# Altium schematic sheet owm_if.SCHDOC
size A4; Organization: Microprocessor-Design Pty Ltd; Address1: 18/110 Caroline Street; Address2: South Yarra; Address3: VIC 3141; Address4: Australia; DocumentNumber: 3; SheetNumber: 3; SheetTotal: 3
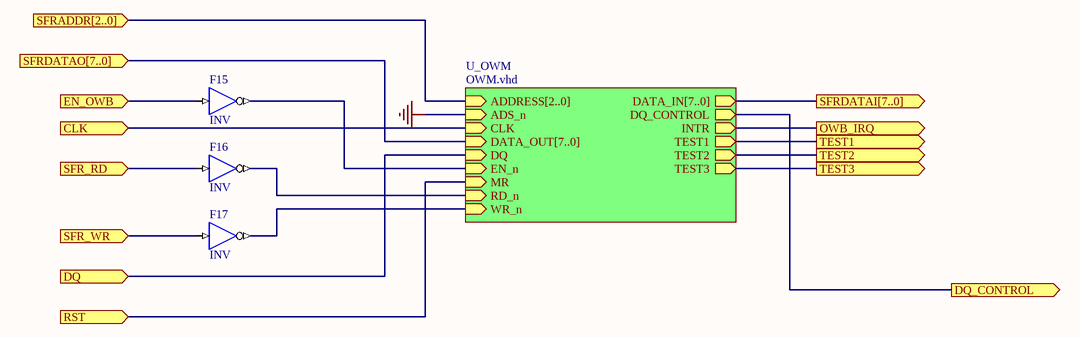
[diagram p0: owm_if.SCHDOC]

## Parts
F15  INV
F16  INV
F17  INV

## Sub-sheets
U_OWM = OWM.vhd: ADDRESS[2..0] (in), ADS_n (in), CLK (in), DATA_IN[7..0] (out), DATA_OUT[7..0] (in), DQ (in), DQ_CONTROL (out), EN_n (in), INTR (out), MR (in), RD_n (in), TEST1 (out), TEST2 (out), TEST3 (out), WR_n (in)  | VHDLENTITY: OWM

## Ports
CLK (in), DQ (in), DQ_CONTROL (out), EN_OWB (in), OWB_IRQ (out), RST (in), SFR_RD (in), SFR_WR (in), SFRADDR[2..0] (in), SFRDATAI[7..0] (out), SFRDATAO[7..0] (in), TEST1 (out), TEST2 (out), TEST3 (out)

## Nets
GND: sheet U_OWM/ADS_n
CLK: port CLK, sheet U_OWM/CLK
DQ: port DQ, sheet U_OWM/DQ
DQ_CONTROL: port DQ_CONTROL, sheet U_OWM/DQ_CONTROL
EN_OWB: F15.I ; port EN_OWB
OWB_IRQ: port OWB_IRQ, sheet U_OWM/INTR
RST: port RST, sheet U_OWM/MR
SFR_RD: F16.I ; port SFR_RD
SFR_WR: F17.I ; port SFR_WR
TEST1: port TEST1, sheet U_OWM/TEST1
TEST2: port TEST2, sheet U_OWM/TEST2
TEST3: port TEST3, sheet U_OWM/TEST3
NetF15_O: F15.O ; sheet U_OWM/EN_n
NetF16_O: F16.O ; sheet U_OWM/RD_n
NetF17_O: F17.O ; sheet U_OWM/WR_n

## Buses and harness runs
bus port SFRADDR[2..0] = sheet U_OWM/ADDRESS[2..0]
bus port SFRDATAI[7..0] = sheet U_OWM/DATA_IN[7..0]
bus port SFRDATAO[7..0] = sheet U_OWM/DATA_OUT[7..0]

## Notes on the sheet
- Title
- Size:
- Date:
- A4
- Number:
- Time:
- Revision:
- Sheet
- of
- File:

## Library data of the parts
F15-F17 = INV: Inverter; ArchiveName: GENERIC; Published: 18-Nov-2003; Publisher: Altium Limited; Xilinx Equivalent: INV; Core Revision: 1.00.00